# Altium project puissance5V3V3.PrjPCB
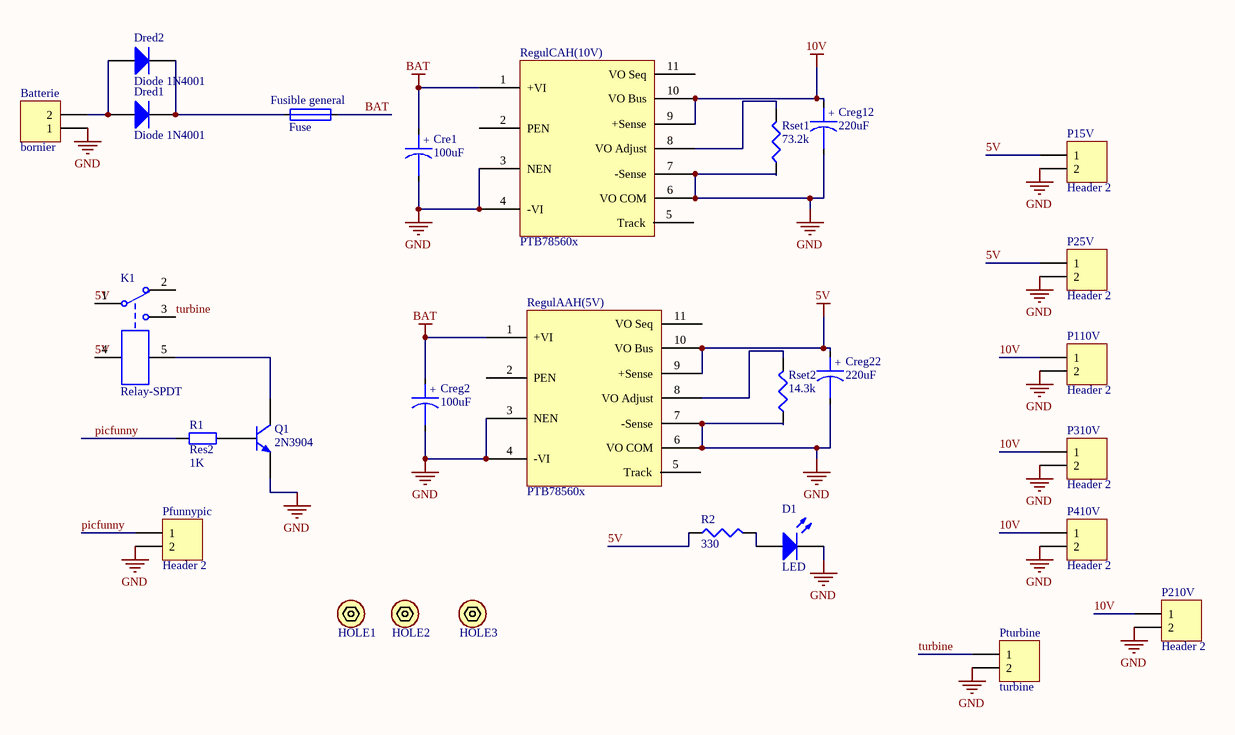
[diagram p0: puissance.SchDoc]
1 sheet, 28 parts. Net scope: global (net labels, ports and power ports of the same name join across sheets).
Board file: PCBpuissance.PcbDoc

## Sheet puissance.SchDoc
size A4

### Parts
Batterie  bornier  [Bornier male coude 2 voies]
Cre1  value 100uF  [RB.1/.3]  (hidden comment: CAP Pol)
Creg2  value 100uF  [RB.1/.3]  (hidden comment: CAP Pol)
Creg12  value 220uF  [RB.1/.3]  (hidden comment: CAP Pol)
Creg22  value 220uF  [RB.1/.3]  (hidden comment: CAP Pol)
D1  LED  [LED 5mm red (dip)]
Dred1  Diode 1N4001  [DO-41]
Dred2  Diode 1N4001  [DO-41]
Fusible_general  Fuse  [Fuse Holder 5x20mm]
HOLE1  Hole  [SCREW]  (value not drawn)
HOLE2  Hole  [SCREW]  (value not drawn)
HOLE3  Hole  [SCREW]  (value not drawn)
K1  Relay-SPDT  [RELAY-SPST]
P15V  Header 2  [Bornier male coude 2 voies]
P25V  Header 2  [Bornier male coude 2 voies]
P110V  Header 2  [Bornier male coude 2 voies]
P210V  Header 2  [Bornier male coude 2 voies]
P310V  Header 2  [Bornier male coude 2 voies]
P410V  Header 2  [Bornier male coude 2 voies]
Pfunnypic  Header 2  [Bornier male coude 2 voies]
Pturbine  turbine  [Bornier male coude 2 voies]
Q1  2N3904  [TO-92A]
R1  Res2  value 1K  [AXIAL-0.4]
R2  value 330  [AXIAL0.8]  (hidden comment: RES)
RegulAAH(5V)  PTB78560x  [PTB78560x]
RegulCAH(10V)  PTB78560x  [PTB78560x]
Rset1  value 73.2k  [AXIAL0.8]  (hidden comment: RES)
Rset2  value 14.3k  [AXIAL0.8]  (hidden comment: RES)

### Nets
5V: Creg22.1 K1.1 K1.4 P15V.1 P25V.1 R2.1 RegulAAH(5V).9(+Sense) RegulAAH(5V).10(VO_Bus)
10V: Creg12.1 P110V.1 P210V.1 P310V.1 P410V.1 RegulCAH(10V).9(+Sense) RegulCAH(10V).10(VO_Bus)
BAT: Cre1.1 Creg2.1 Fusible_general.2 RegulAAH(5V).1(+VI) RegulCAH(10V).1(+VI)
GND: Batterie.1 Cre1.2 Creg2.2 Creg12.2 Creg22.2 D1.K P15V.2 P25V.2 P110V.2 P210V.2 P310V.2 P410V.2 Pfunnypic.2 Pturbine.2 Q1.1(E) RegulAAH(5V).3(NEN) RegulAAH(5V).4(-VI) RegulAAH(5V).6(VO_COM) RegulAAH(5V).7(-Sense) RegulCAH(10V).3(NEN) RegulCAH(10V).4(-VI) RegulCAH(10V).6(VO_COM) RegulCAH(10V).7(-Sense) Rset1.1 Rset2.1
picfunny: Pfunnypic.1 R1.1
turbine: K1.3 Pturbine.1
NetBatterie_2: Batterie.2 Dred1.1(A) Dred2.1(A)
NetD1_A: D1.A R2.2
NetDred1_2: Dred1.2(K) Dred2.2(K) Fusible_general.1
NetK1_5: K1.5 Q1.3(C)
NetQ1_2: Q1.2(B) R1.2
NetRegulAAH(5V)_8: RegulAAH(5V).8(VO_Adjust) Rset2.2
NetRegulCAH(10V)_8: RegulCAH(10V).8(VO_Adjust) Rset1.2

Not connected (* = marked no-connect by the designer): HOLE1 1(Hole); HOLE2 1(Hole); HOLE3 1(Hole); K1 2; RegulAAH(5V) 2(PEN) 5(Track) 11(VO_Seq); RegulCAH(10V) 2(PEN) 5(Track) 11(VO_Seq)

### Notes on the sheet
- (in symbol CAP Pol) +

### Library data of the parts
Batterie P15V P25V P110V P210V P310V P410V Pfunnypic Pturbine = Header 2: Header, 2-Pin; LatestRevisionDate: 17-Jul-2002; LatestRevisionNote: Re-released for DXP Platform.; Publisher: Altium Limited
Cre1 Creg2 Creg12 Creg22 = CAP Pol: Polarized Capacitor
D1 = LED: Typical LED; Published: 8-Jun-2000; LatestRevisionDate: 17-Jul-2002; LatestRevisionNote: Re-released for DXP Platform.; PackageVersion: Feb-2002; PackageReference: 3.2X1.6X1.1; Publisher: Altium Limited; PackageDescription: SM LED; 2 Flat Leads
Dred1 Dred2 = Diode 1N4001: 1 Amp General Purpose Rectifier; Published: 8-Jun-2000; LatestRevisionDate: 17-Jul-2002; LatestRevisionNote: Re-released for DXP Platform.; DatasheetVersion: 1998; PackageVersion: Aug-1999; PackageReference: DO-41; Publisher: Altium Limited; PackageDescription: Diode, Axial; Body 5.2 x 2.7 mm (LxDia. max), Lead Dia. 0.86 mm (max); Code_JEDEC: DO-204-AL; ComponentLink1Description: Manufacturer Link; ComponentLink1URL: http://www.fairchildsemi.com/; ComponentLink2Description: Datasheet; ComponentLink2URL: http://www.fairchildsemi.com/ds/1N%2F1N4001.pdf
HOLE1-HOLE3 = Hole: Mounting Hole for screws
K1 = Relay-SPDT: Single-Pole Dual-Throw Relay; Published: 24-Mar-1999; LatestRevisionDate: 17-Jul-2002; LatestRevisionNote: Re-released for DXP Platform.; PackageReference: MODULE5B; Publisher: Altium Limited
Q1 = 2N3904: NPN General Purpose Amplifier; Published: 8-Jun-2000; LatestRevisionDate: 15-Jan-2003; LatestRevisionNote: PCB Footprint 'BCY-W3/D4.7' replaced; DatasheetVersion: 1997; PackageVersion: Sep-1998; PackageReference: TO-92A; Publisher: Altium Limited; PackageDescription: TO, Flat Index; 3 In-Line, Axial Leads; Body Dia. 4.5mm; Leads 0.51 x 0.48 mm (max); ComponentLink1Description: Manufacturer Link; ComponentLink1URL: http://www.fairchildsemi.com/; ComponentLink2Description: Datasheet; ComponentLink2URL: http://www.fairchildsemi.com/ds/2N%2F2N3904.pdf
R1 = Res2: Resistor; Published: 8-Jun-2000; LatestRevisionDate: 17-Jul-2002; LatestRevisionNote: Re-released for DXP Platform.; PackageReference: AXIAL-0.4; Publisher: Altium Limited; PackageDescription: Axial Device, Thru-Hole; 2 Leads; 0.4 in Pin Spacing
R2 Rset1 Rset2 = RES: Resistor; Published: 8-Jun-2000; LatestRevisionDate: 29-May-2009; LatestRevisionNote: IPC-7351 Footprint Added.; PackageReference: J1-0603; Publisher: Altium Limited; PackageDescription: Chip Resistor
RegulAAH(5V) RegulCAH(10V) = PTB78560x: Texas Instruments Regulators